# EAGLE design RGB led breakout (EAGLE 8.7.0)
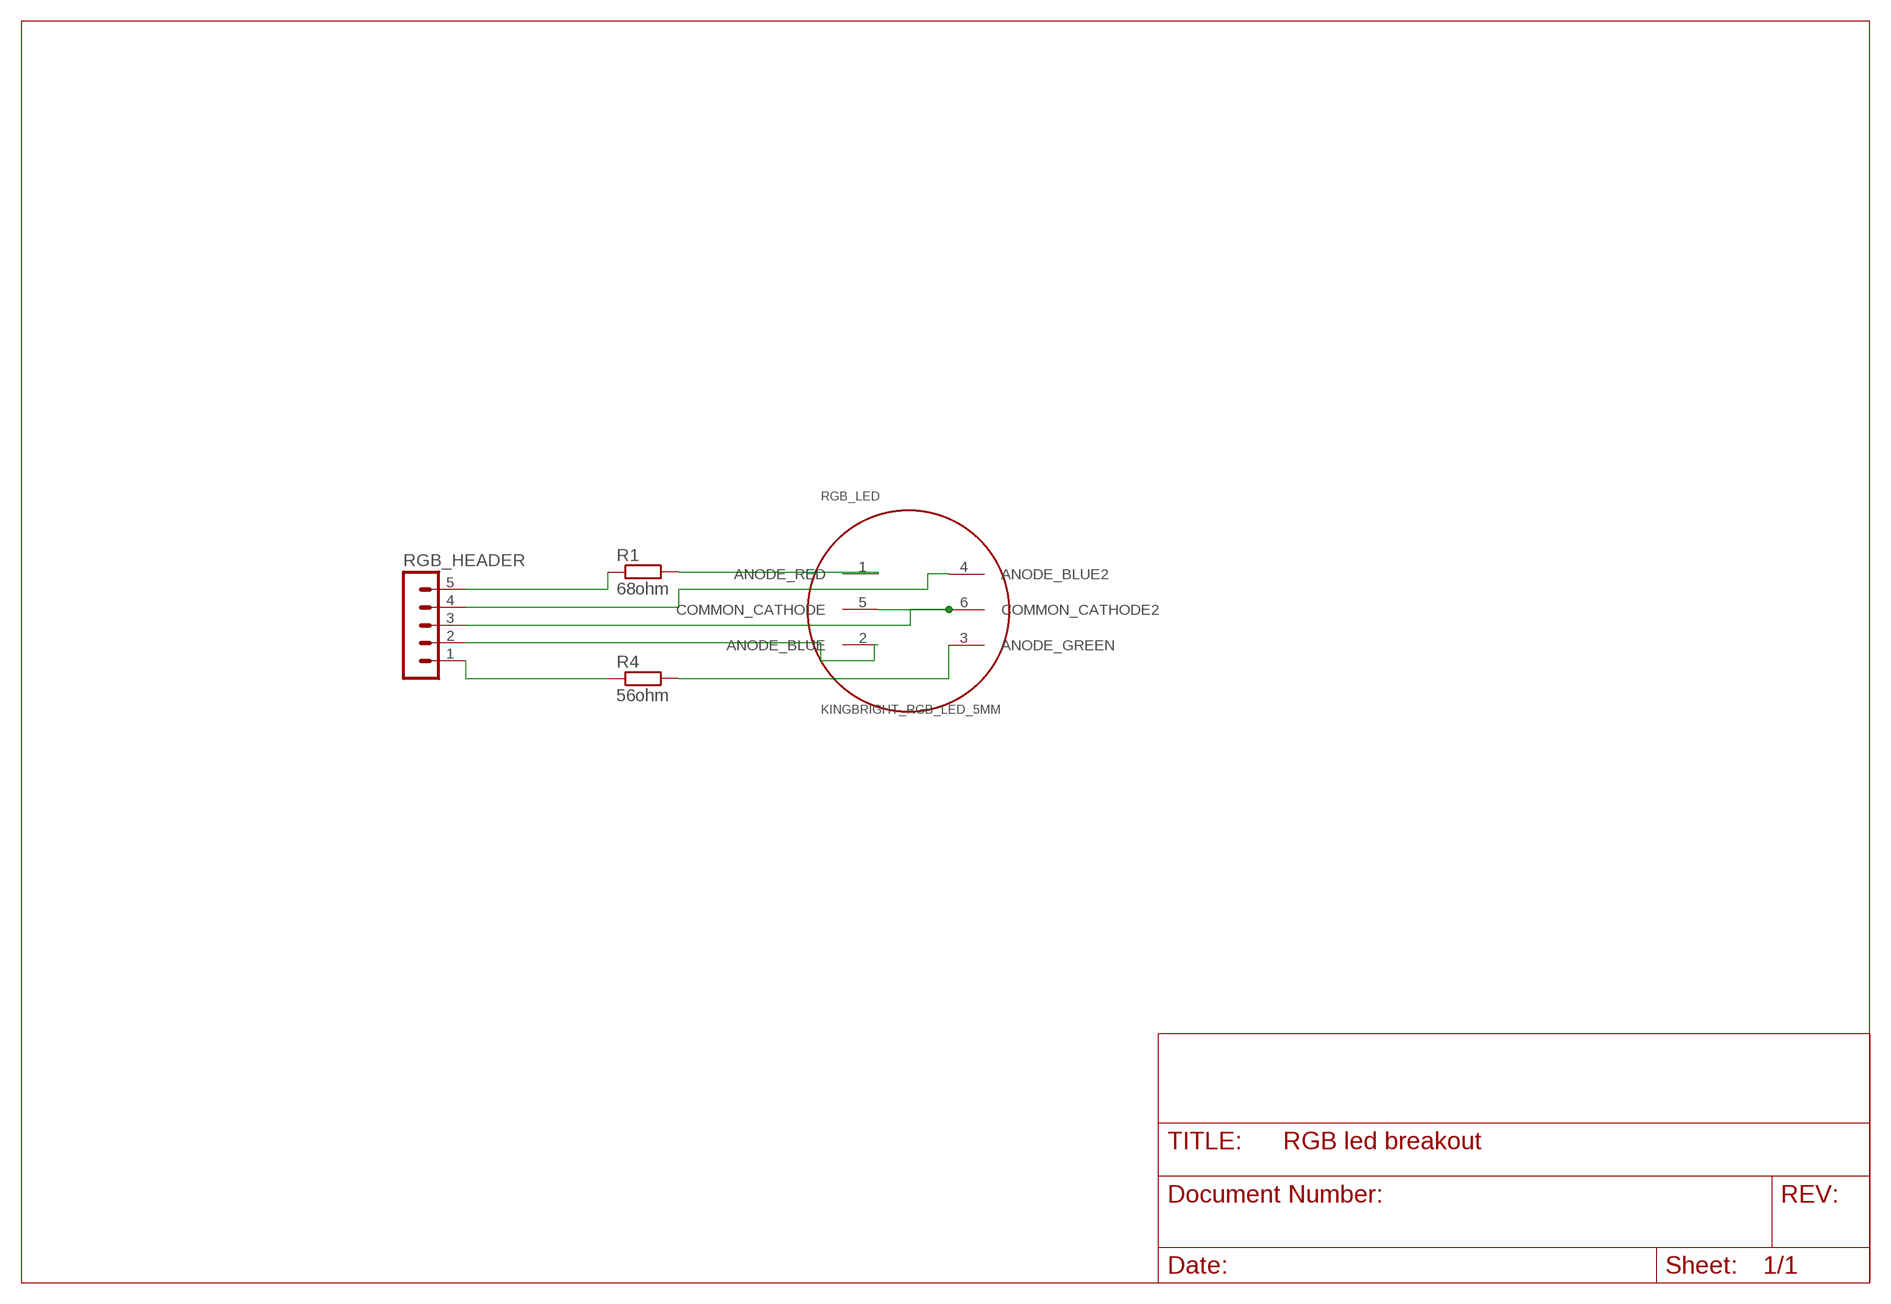
[diagram p0: schematic, sheet 1]

## Parts
R1  68ohm  R-EU_0207/7  [0207/7]
R4  56ohm  R-EU_0207/7  [0207/7]
RGB_HEADER  MA05-1  [MA05-1]
RGB_LED  KINGBRIGHT_RGB_LED_5MM  [LF5WAEMBGMBW]

## Nets
CATHODE: RGB_HEADER.3 RGB_LED.5(COMMON_CATHODE) RGB_LED.6(COMMON_CATHODE2)
N$1: R1.2 RGB_LED.1(ANODE_RED)
N$2: R4.2 RGB_LED.3(ANODE_GREEN)
N$4: R1.1 RGB_HEADER.5
N$5: RGB_HEADER.4 RGB_LED.4(ANODE_BLUE2)
N$6: RGB_HEADER.2 RGB_LED.2(ANODE_BLUE)
N$7: R4.1 RGB_HEADER.1

## Library data of the parts
R1 R4 = resistor:R-EU_: RESISTOR, European symbol
RGB_HEADER = con-lstb:MA05-1: PIN HEADER; OC_FARNELL: unknown; OC_NEWARK: unknown
RGB_LED = heksalab:KINGBRIGHT_RGB_LED_5MM: Kingbright full color RGB LED

## Board
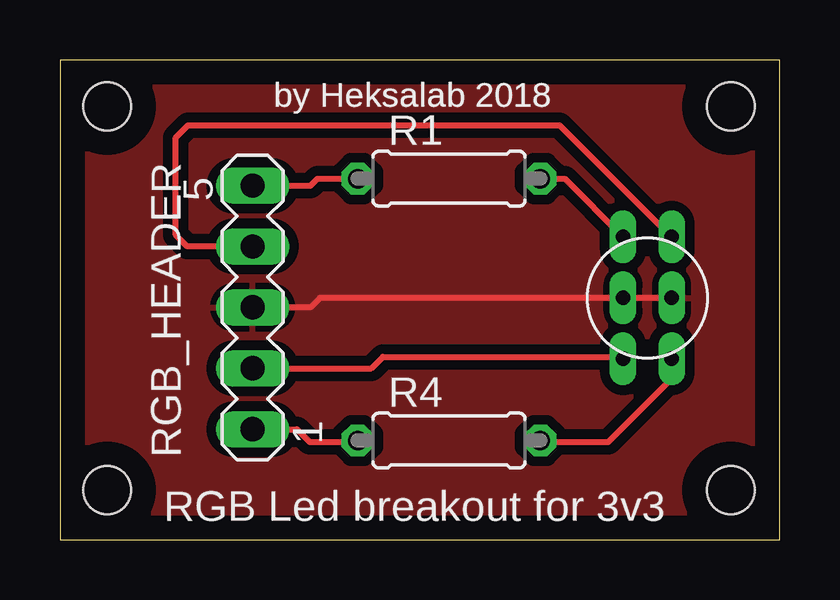
[diagram p1: board, top side]

Size 30 x 20 mm. Coordinates in mm from the lower left corner, seen from the top.
Outline: 0,0 30,0 30,20 0,20 0,0
Copper layers (1*16): Top 0.035mm / dielectric 1.5mm / Bottom 0.035mm
Design rules "default": minimum track width 6mil, minimum drill 0.35mm, track to track 6mil, track to pad 6mil, pad to pad 6mil, via to via 6mil, smd to smd 6mil, copper to edge 40mil, drill to drill 6mil, minimum pad ring 10mil, minimum via ring 8mil, stop-mask expansion 4mil, vias tented up to drill 0mil, thermal gap 10mil
Holes 2 mm at 1.97,18.06 1.97,2.06 27.97,18.06 27.97,2.06

### Footprints (pad centres in the part's own frame; a part is rotated, then mirrored left to right if it is on the bottom)
0207/7 = drill 0.813 octagon: 1 -3.81,0; 2 3.81,0
MA05-1 = drill 1.016 long: 1 -5.08,0; 2 -2.54,0; 3 0,0; 4 2.54,0; 5 5.08,0
LF5WAEMBGMBW = drill 0.6 long: 1 -1.016,2.54; 2 -1.016,-2.54; 3 1.016,-2.54; 4 1.016,2.54; 5 -1.016,0; 6 1.016,0

### Placement (x,y rotation side)
R1  16.22,15.05 0 top
R4  16.22,4.13 0 top
RGB_HEADER  8.03,9.68 90 top
RGB_LED  24.49,10.08 0 top

### Tracks (layer width: path | path; a pad name or v marks a point on that pad's centre or on a via)
CATHODE
  Top 0.254: RGB_LED.6 RGB_LED.5 10.84,10.08 10.44,9.68 RGB_HEADER.3
  pour Top (isolate 0.406): 0,20.07 29.97,20.07 29.97,0 0,0
N$1
  Top 0.254: R1.2 21.04,15.05 RGB_LED.1
N$2
  Top 0.254: R4.2 20.1,4.06 22.86,4.06 25.65,6.86 25.51,7.01 RGB_LED.3
N$4
  Top 0.254: RGB_HEADER.5 10.44,14.76 10.73,15.05 R1.1
N$5
  Top 0.254: RGB_HEADER.4 5.31,12.22 4.83,12.7 4.83,16.76 5.33,17.27 20.83,17.27 25.48,12.62 RGB_LED.4
N$6
  Top 0.254: RGB_HEADER.2 12.98,7.14 13.46,7.62 23.39,7.62 RGB_LED.2
N$7
  Top 0.254: RGB_HEADER.1 9.88,4.6 10.41,4.06 12.34,4.06 R4.1

### Text on the board
tNames: by Heksalab 2018 | by Heksalab 2018 | RGB Led breakout for 3v3
Document: RED | BLUE2 | common cathode | BLUE1 | GREEN